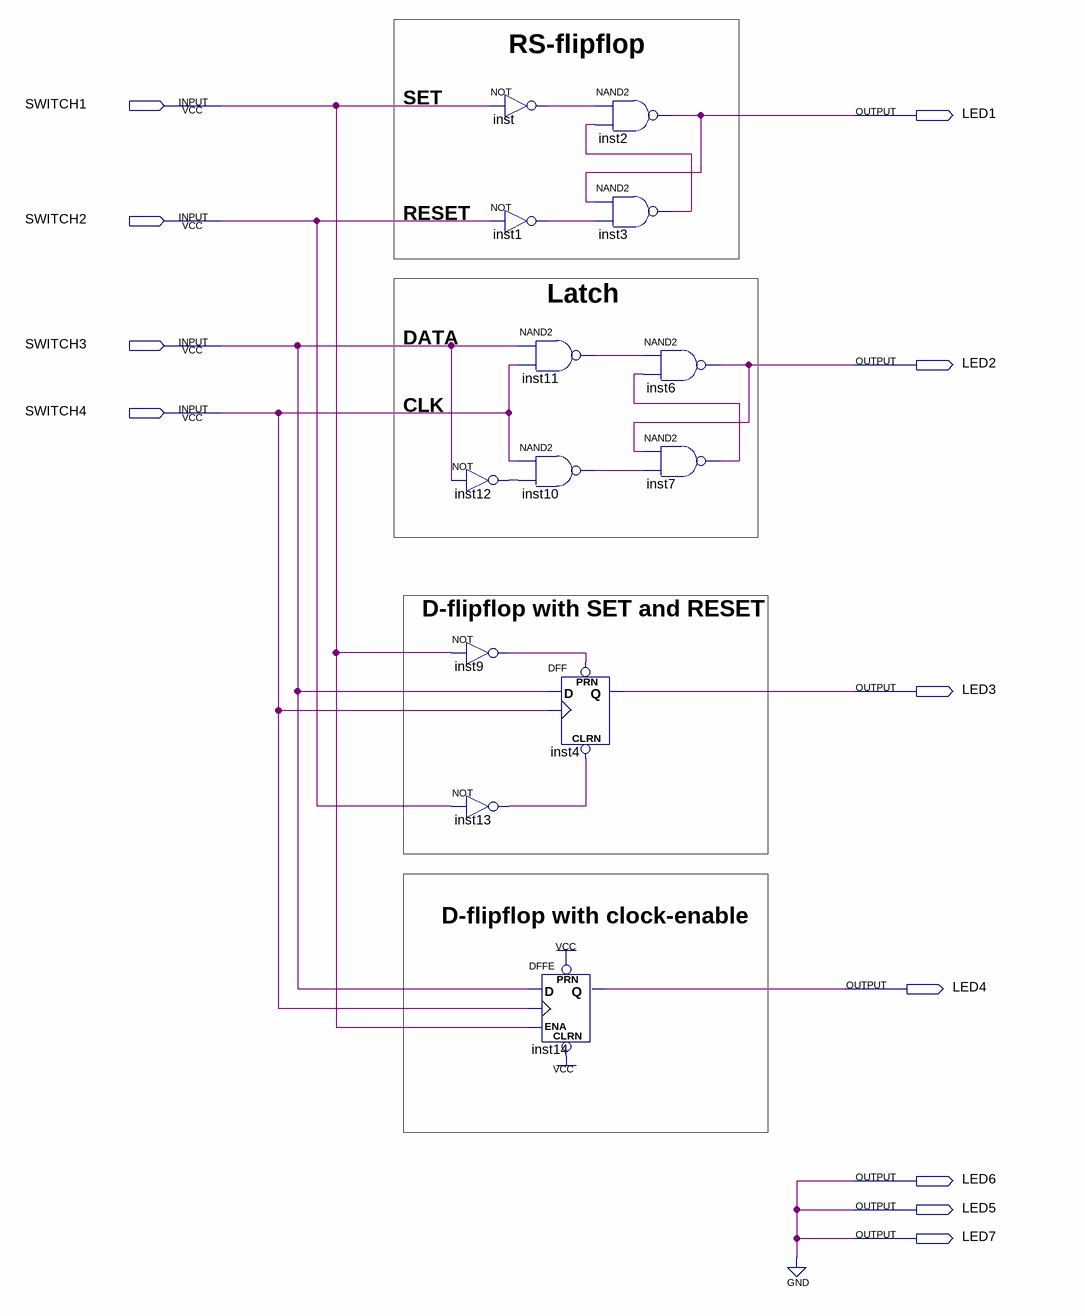
[diagram p0: schematic sheet]
// Quartus schematic ex5.bdf as structural Verilog: 13 symbols, 11 pins
module ex5 (
  input  SWITCH1,
  input  SWITCH2,
  input  SWITCH3,
  input  SWITCH4,
  output LED1,
  output LED2,
  output LED3,
  output LED4,
  output LED6,
  output LED5,
  output LED7
);

  wire inst1_out, inst3_out, inst7_out, inst9_out, inst10_out, inst11_out, inst12_out, inst13_out, inst_out;

  not inst (inst_out, SWITCH1);
  not inst1 (inst1_out, SWITCH2);
  nand inst11 (inst11_out, SWITCH3, SWITCH4);
  nand inst10 (inst10_out, SWITCH4, inst12_out);
  not inst12 (inst12_out, SWITCH3);
  not inst9 (inst9_out, SWITCH1);
  not inst13 (inst13_out, SWITCH2);
  nand inst2 (LED1, inst_out, inst3_out);
  nand inst3 (inst3_out, LED1, inst1_out);
  DFF inst4 (.CLRN(inst13_out), .CLK(SWITCH4), .D(SWITCH3), .PRN(inst9_out), .Q(LED3));
  DFFE inst14 (.PRN(1'b1), .CLRN(1'b1), .D(SWITCH3), .CLK(SWITCH4), .ENA(SWITCH1), .Q(LED4));
  nand inst6 (LED2, inst11_out, inst7_out);
  nand inst7 (inst7_out, LED2, inst10_out);

  assign LED5 = 1'b0;
  assign LED6 = 1'b0;
  assign LED7 = 1'b0;

  // Notes on the sheet:
  //   RS-flipflop
  //   SET
  //   RESET
  //   Latch
  //   DATA
  //   CLK
  //   D-flipflop with SET and RESET
  //   D-flipflop with clock-enable
endmodule
